# Altium schematic sheet CONNECTROS.SchDoc
size A
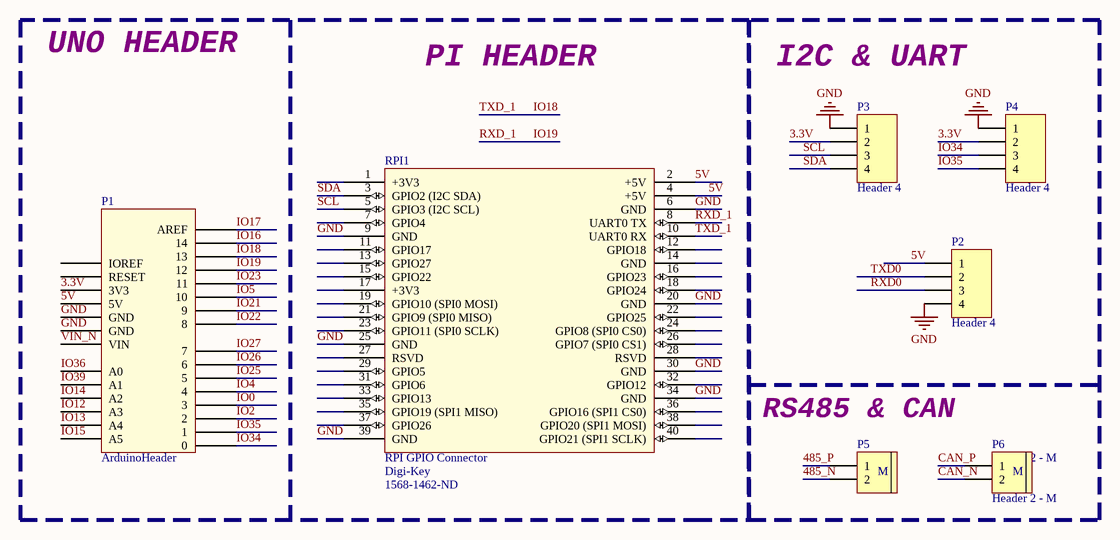
[diagram p0: CONNECTROS.SchDoc]

## Parts
P1  ArduinoHeader  [Arduino_header]
P2  Header 4  [HDR1X4]
P3  Header 4  [HDR1X4]
P4  Header 4  [HDR1X4]
P5  Header 2 - M  [Medium - Header 2]
P6  Header 2 - M  [Medium - Header 2]
RPI1  RPI GPIO Connector  Supplier 1: Digi-Key  Supplier Part Number 1: 1568-1462-ND  [rpi]

## Blocks framed on the sheet
I2C & UART: P2-P6

## Nets
GND: P1.GND P2.4 P3.1 P4.1 RPI1.6(GND) RPI1.9(GND) RPI1.20(GND) RPI1.25(GND) RPI1.30(GND) RPI1.34(GND) RPI1.39(GND)
3.3V: P1.3V3 P3.2 P4.2
5V: P1.5V P2.1 RPI1.2(+5V) RPI1.4(+5V)
485_N: P5.2
485_P: P5.1
CAN_N: P6.2
CAN_P: P6.1
IO0: P1.3
IO2: P1.2
IO4: P1.4
IO5: P1.10
IO12: P1.A3
IO13: P1.A4
IO14: P1.A2
IO15: P1.A5
IO16: P1.14
IO17: P1.AREF
IO18: P1.13 RPI1.10(UART0_RX)  [also labelled TXD_1]
IO19: P1.12 RPI1.8(UART0_TX)  [also labelled RXD_1]
IO21: P1.9
IO22: P1.8
IO23: P1.11
IO25: P1.5
IO26: P1.6
IO27: P1.7
IO34: P1.0 P4.3
IO35: P1.1 P4.4
IO36: P1.A0
IO39: P1.A1
RXD0: P2.3
SCL: P3.3 RPI1.5(GPIO3_(I2C_SCL))
SDA: P3.4 RPI1.3(GPIO2_(I2C_SDA))
TXD0: P2.2
VIN_N: P1.VIN

Not connected (* = marked no-connect by the designer): P1 IOREF RESET; RPI1 1(+3V3) 7(GPIO4) 11(GPIO17) 12(GPIO18) 13(GPIO27) 14(GND) 15(GPIO22) 16(GPIO23) 17(+3V3) 18(GPIO24) 19(GPIO10_(SPI0_MOSI)) 21(GPIO9_(SPI0_MISO)) 22(GPIO25) 23(GPIO11_(SPI0_SCLK)) 24(GPIO8_(SPI0_CS0)) 26(GPIO7_(SPI0_CS1)) 27(RSVD) 28(RSVD) 29(GPIO5) 31(GPIO6) 32(GPIO12) 33(GPIO13) 35(GPIO19_(SPI1_MISO)) 36(GPIO16_(SPI1_CS0)) 37(GPIO26) 38(GPIO20_(SPI1_MOSI)) 40(GPIO21_(SPI1_SCLK))

## Notes on the sheet
- UNO HEADER
- PI HEADER
- (near P5) RS485 & CAN
- (in symbol Header 2 - M) M

## Library data of the parts
P2-P4 = Header 4: Header, 4-Pin; LatestRevisionDate: 17-Jul-2002; LatestRevisionNote: Re-released for DXP Platform.; Publisher: Altium Limited
P5 P6 = Header 2 - M: Header, 2-Pin, Medium; LatestRevisionDate: 17-Jul-2002; LatestRevisionNote: Re-released for DXP Platform.; Publisher: Altium Limited
RPI1 = rpi connector: GPIO Header for Raspberry Pi A+/B+/Pi 2/Pi 3 - 2x20; Manufacturer: SparkFun Electronics; Manufacturer Part Number: PRT-14017; Nils Minor: author; nilsminor@web.de: mail; RoHS: RoHS Compliant; Category: Development Boards, Kits, Programmers; Stock 1: 150; Pricing 1: 1=1.84 (EUR); Part Status: Active; Accessory Type: Connector; For Use With/Related Products: Raspberry Pi; ComponentLink1URL: https://cdn.sparkfun.com/datasheets/Dev/RaspberryPi/12313.pdf; ComponentLink1Description: https://cdn.sparkfun.com/datasheets/Dev/RaspberryPi/12313.pdf